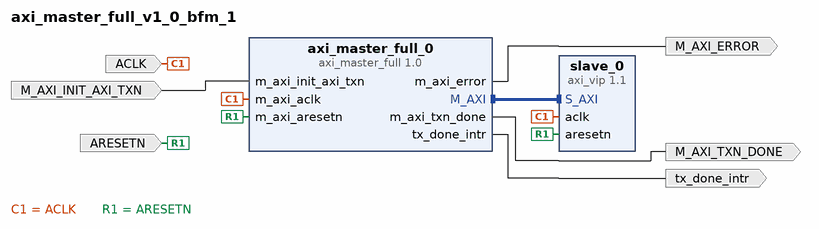
[diagram p0: block diagram of the top level]
# Vivado block design axi_master_full_v1_0_bfm_1, xc7z010clg400-1, Vivado 2021.1
create_bd_design axi_master_full_v1_0_bfm_1

create_bd_port -dir I -type clk ACLK
set_property -dict [list \
  CONFIG.ASSOCIATED_RESET ARESETN \
  CONFIG.CLK_DOMAIN axi_master_full_v1_0_bfm_1_ACLK \
  CONFIG.FREQ_HZ 100000000 \
  CONFIG.PHASE 0.000 \
] [get_bd_ports ACLK]
create_bd_port -dir I -type rst ARESETN
set_property -dict {CONFIG.POLARITY ACTIVE_LOW} [get_bd_ports ARESETN]
create_bd_port -dir I M_AXI_INIT_AXI_TXN
create_bd_port -dir O M_AXI_ERROR
create_bd_port -dir O M_AXI_TXN_DONE
create_bd_port -dir O -type intr tx_done_intr

create_bd_cell -type ip -vlnv xilinx.com:ip:axi_vip:1.1 slave_0
set_property -dict {CONFIG.INTERFACE_MODE SLAVE CONFIG.PROTOCOL AXI4} [get_bd_cells slave_0]
create_bd_cell -type ip -vlnv user.org:user:axi_master_full:1.0 axi_master_full_0

# ---- connections ----

connect_bd_intf_net [get_bd_intf_pins axi_master_full_0/M_AXI] [get_bd_intf_pins slave_0/S_AXI]
connect_bd_net [get_bd_ports ACLK] [get_bd_pins slave_0/aclk] [get_bd_pins axi_master_full_0/m_axi_aclk]
connect_bd_net [get_bd_ports M_AXI_INIT_AXI_TXN] [get_bd_pins axi_master_full_0/m_axi_init_axi_txn]
connect_bd_net -net aresetn_net [get_bd_ports ARESETN] [get_bd_pins slave_0/aresetn] [get_bd_pins axi_master_full_0/m_axi_aresetn]
connect_bd_net [get_bd_pins axi_master_full_0/m_axi_error] [get_bd_ports M_AXI_ERROR]
connect_bd_net [get_bd_pins axi_master_full_0/m_axi_txn_done] [get_bd_ports M_AXI_TXN_DONE]
connect_bd_net [get_bd_pins axi_master_full_0/tx_done_intr] [get_bd_ports tx_done_intr]

validate_bd_design
save_bd_design
